# Altium schematic sheet IR.SchDoc
size A4
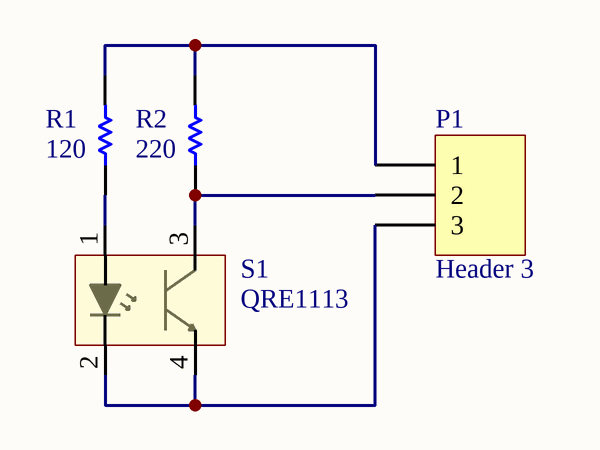
[diagram p0: IR.SchDoc]

## Parts
P1  Header 3  [HDR1X3]
R1  value 120  [J1-0603]  (hidden comment: Res1)
R2  value 220  [J1-0603]  (hidden comment: Res1)
S1  QRE1113  [QRE1113GR]

## Nets
NetP1_1: P1.1 R1.2 R2.2
NetP1_2: P1.2 R2.1 S1.3(+)
NetP1_3: P1.3 S1.2 S1.4
NetR1_1: R1.1 S1.1(+)

## Library data of the parts
P1 = Header 3: Header, 3-Pin; LatestRevisionDate: 17-Jul-2002; LatestRevisionNote: Re-released for DXP Platform.; Publisher: Altium Limited
R1 R2 = Res1: Resistor; Published: 8-Jun-2000; LatestRevisionDate: 17-Jul-2002; LatestRevisionNote: Re-released for DXP Platform.; PackageReference: AXIAL-0.3; Publisher: Altium Limited; PackageDescription: Axial Device, Thru-Hole; 2 Leads; 0.3 in Pin Spacing